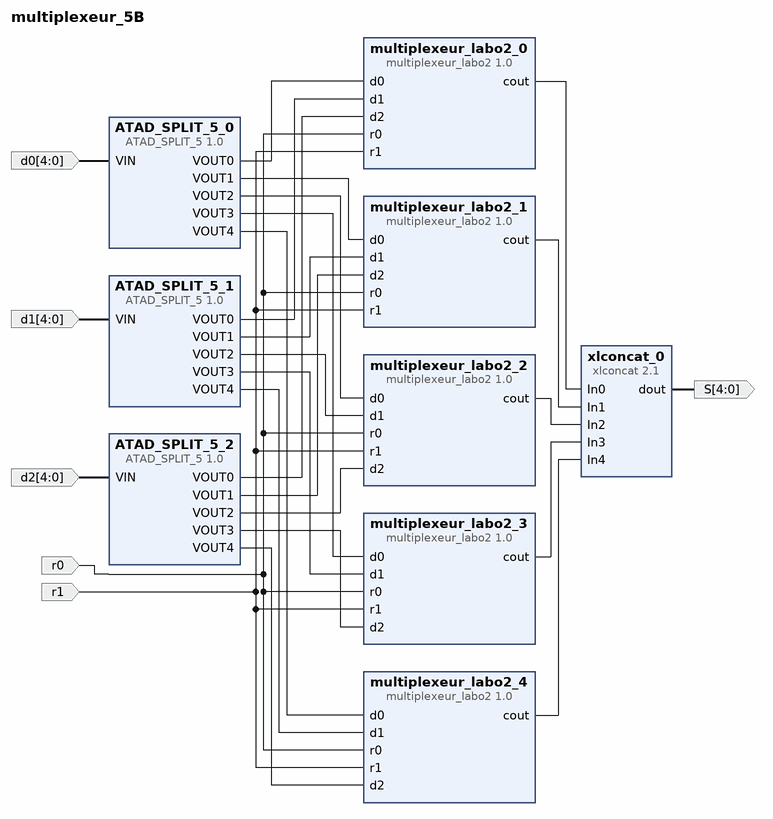
[diagram p0: block diagram of the top level]
# Vivado block design multiplexeur_5B, xc7a100tcsg324-1, Vivado 2018.3
create_bd_design multiplexeur_5B

create_bd_port -dir I -from 4 -to 0 d0
create_bd_port -dir I -from 4 -to 0 d1
create_bd_port -dir I -from 4 -to 0 d2
create_bd_port -dir I r0
create_bd_port -dir I r1
create_bd_port -dir O -from 4 -to 0 S

create_bd_cell -type ip -vlnv xilinx.com:user:ATAD_SPLIT_5:1.0 ATAD_SPLIT_5_0
create_bd_cell -type ip -vlnv xilinx.com:user:ATAD_SPLIT_5:1.0 ATAD_SPLIT_5_1
create_bd_cell -type ip -vlnv xilinx.com:user:ATAD_SPLIT_5:1.0 ATAD_SPLIT_5_2
create_bd_cell -type ip -vlnv xilinx.com:ip:xlconcat:2.1 xlconcat_0
set_property -dict {CONFIG.NUM_PORTS 5} [get_bd_cells xlconcat_0]
create_bd_cell -type ip -vlnv polymtl.ca:user:multiplexeur_labo2:1.0 multiplexeur_labo2_0
create_bd_cell -type ip -vlnv polymtl.ca:user:multiplexeur_labo2:1.0 multiplexeur_labo2_1
create_bd_cell -type ip -vlnv polymtl.ca:user:multiplexeur_labo2:1.0 multiplexeur_labo2_2
create_bd_cell -type ip -vlnv polymtl.ca:user:multiplexeur_labo2:1.0 multiplexeur_labo2_3
create_bd_cell -type ip -vlnv polymtl.ca:user:multiplexeur_labo2:1.0 multiplexeur_labo2_4

# ---- connections ----

connect_bd_net -net d0_1 [get_bd_ports d0] [get_bd_pins ATAD_SPLIT_5_0/VIN]
connect_bd_net -net d1_1 [get_bd_ports d1] [get_bd_pins ATAD_SPLIT_5_1/VIN]
connect_bd_net -net d2_1 [get_bd_ports d2] [get_bd_pins ATAD_SPLIT_5_2/VIN]
connect_bd_net [get_bd_pins xlconcat_0/dout] [get_bd_ports S]
connect_bd_net [get_bd_pins ATAD_SPLIT_5_0/VOUT0] [get_bd_pins multiplexeur_labo2_0/d0]
connect_bd_net [get_bd_pins ATAD_SPLIT_5_1/VOUT0] [get_bd_pins multiplexeur_labo2_0/d1]
connect_bd_net [get_bd_pins ATAD_SPLIT_5_2/VOUT0] [get_bd_pins multiplexeur_labo2_0/d2]
connect_bd_net [get_bd_pins ATAD_SPLIT_5_0/VOUT1] [get_bd_pins multiplexeur_labo2_1/d0]
connect_bd_net [get_bd_pins ATAD_SPLIT_5_1/VOUT1] [get_bd_pins multiplexeur_labo2_1/d1]
connect_bd_net [get_bd_pins ATAD_SPLIT_5_2/VOUT1] [get_bd_pins multiplexeur_labo2_1/d2]
connect_bd_net [get_bd_pins ATAD_SPLIT_5_0/VOUT2] [get_bd_pins multiplexeur_labo2_2/d0]
connect_bd_net [get_bd_pins ATAD_SPLIT_5_1/VOUT2] [get_bd_pins multiplexeur_labo2_2/d1]
connect_bd_net [get_bd_pins ATAD_SPLIT_5_2/VOUT2] [get_bd_pins multiplexeur_labo2_2/d2]
connect_bd_net [get_bd_pins ATAD_SPLIT_5_0/VOUT3] [get_bd_pins multiplexeur_labo2_3/d0]
connect_bd_net [get_bd_pins ATAD_SPLIT_5_1/VOUT3] [get_bd_pins multiplexeur_labo2_3/d1]
connect_bd_net [get_bd_pins ATAD_SPLIT_5_2/VOUT3] [get_bd_pins multiplexeur_labo2_3/d2]
connect_bd_net [get_bd_pins ATAD_SPLIT_5_0/VOUT4] [get_bd_pins multiplexeur_labo2_4/d0]
connect_bd_net [get_bd_pins ATAD_SPLIT_5_1/VOUT4] [get_bd_pins multiplexeur_labo2_4/d1]
connect_bd_net [get_bd_pins ATAD_SPLIT_5_2/VOUT4] [get_bd_pins multiplexeur_labo2_4/d2]
connect_bd_net [get_bd_pins multiplexeur_labo2_0/cout] [get_bd_pins xlconcat_0/In0]
connect_bd_net [get_bd_pins multiplexeur_labo2_1/cout] [get_bd_pins xlconcat_0/In1]
connect_bd_net [get_bd_pins multiplexeur_labo2_2/cout] [get_bd_pins xlconcat_0/In2]
connect_bd_net [get_bd_pins multiplexeur_labo2_3/cout] [get_bd_pins xlconcat_0/In3]
connect_bd_net [get_bd_pins multiplexeur_labo2_4/cout] [get_bd_pins xlconcat_0/In4]
connect_bd_net -net r0_1 [get_bd_ports r0] \
  [get_bd_pins multiplexeur_labo2_0/r0] [get_bd_pins multiplexeur_labo2_1/r0] [get_bd_pins multiplexeur_labo2_2/r0] \
  [get_bd_pins multiplexeur_labo2_3/r0] [get_bd_pins multiplexeur_labo2_4/r0]
connect_bd_net -net r1_1 [get_bd_ports r1] \
  [get_bd_pins multiplexeur_labo2_4/r1] [get_bd_pins multiplexeur_labo2_3/r1] [get_bd_pins multiplexeur_labo2_2/r1] \
  [get_bd_pins multiplexeur_labo2_1/r1] [get_bd_pins multiplexeur_labo2_0/r1]

validate_bd_design
save_bd_design
